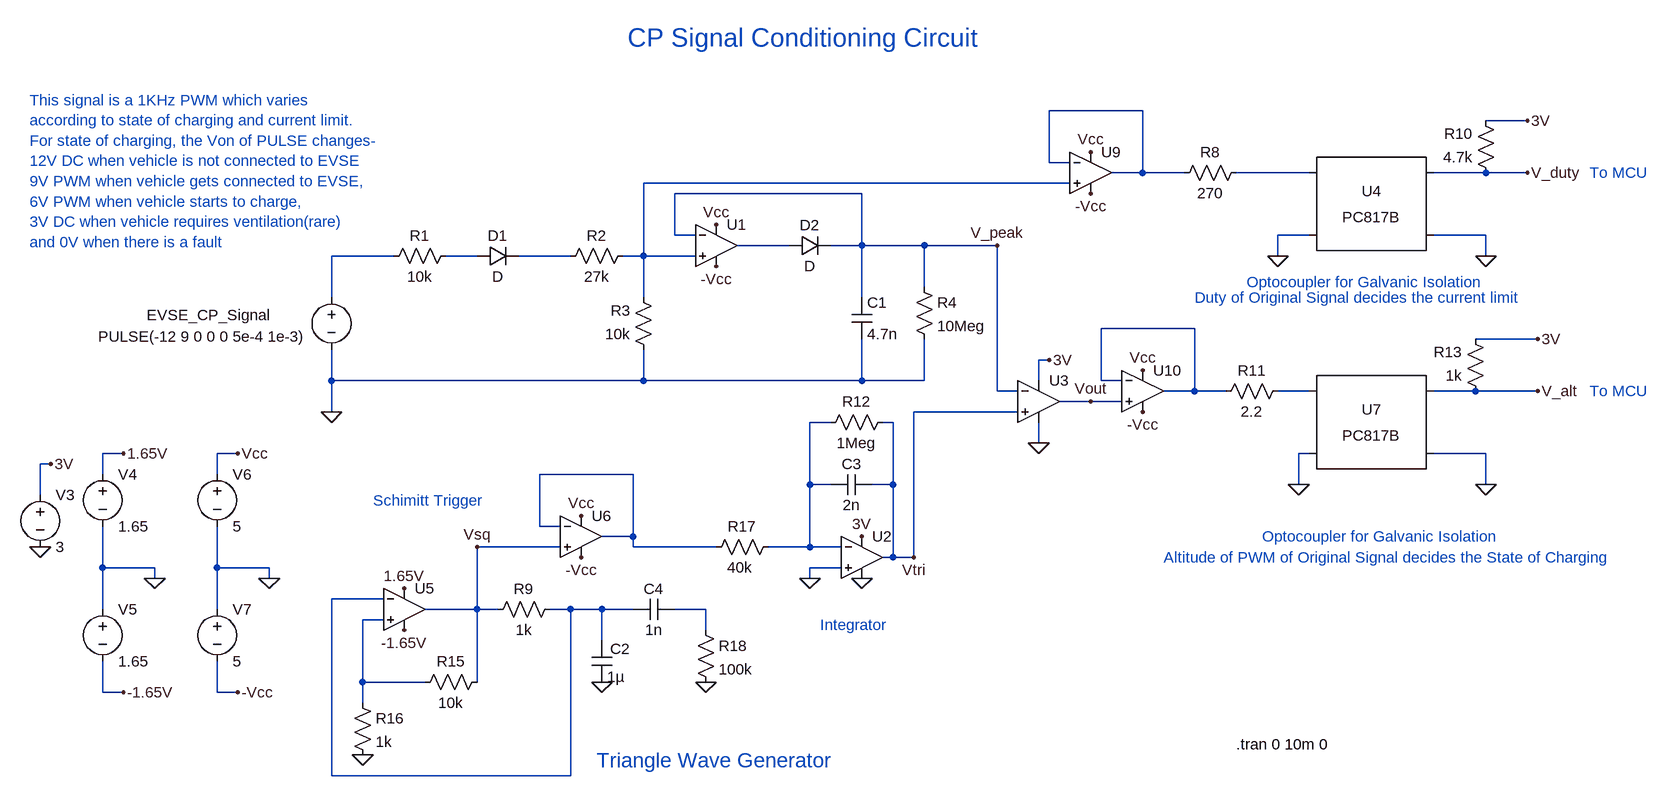
[diagram p0: schematic CP signal.asc]
CP signal.asc, the LTspice schematic file:
Version 4.1
SHEET 1 2740 1312
WIRE 912 -64 768 -64
WIRE 1504 -48 1440 -48
WIRE 768 16 768 -64
WIRE 800 16 768 16
WIRE 912 32 912 -64
WIRE 912 32 864 32
WIRE 976 32 912 32
WIRE 1168 32 1056 32
WIRE 1440 32 1360 32
WIRE 1504 32 1440 32
WIRE 800 48 144 48
WIRE 480 64 192 64
WIRE 192 128 192 64
WIRE 224 128 192 128
WIRE 1168 128 1120 128
WIRE 1440 128 1360 128
WIRE 368 144 288 144
WIRE 480 144 480 64
WIRE 480 144 432 144
WIRE 576 144 480 144
WIRE 688 144 576 144
WIRE -240 160 -336 160
WIRE -112 160 -160 160
WIRE 32 160 -48 160
WIRE 144 160 144 48
WIRE 144 160 112 160
WIRE 224 160 144 160
WIRE 1120 160 1120 128
WIRE 1440 160 1440 128
WIRE 576 208 576 144
WIRE -336 224 -336 160
WIRE 144 224 144 160
WIRE 480 224 480 144
WIRE 992 272 848 272
WIRE 1520 288 1424 288
WIRE 768 320 752 320
WIRE -336 352 -336 304
WIRE 144 352 144 304
WIRE 144 352 -336 352
WIRE 480 352 480 288
WIRE 480 352 144 352
WIRE 576 352 576 288
WIRE 576 352 480 352
WIRE 752 352 752 320
WIRE 848 352 848 272
WIRE 880 352 848 352
WIRE 688 368 688 144
WIRE 720 368 688 368
WIRE 992 368 992 272
WIRE 992 368 944 368
WIRE 1040 368 992 368
WIRE 1168 368 1120 368
WIRE 1424 368 1360 368
WIRE 1520 368 1424 368
WIRE 832 384 784 384
WIRE 880 384 832 384
WIRE -336 400 -336 352
WIRE 720 400 560 400
WIRE 432 416 400 416
WIRE 528 416 512 416
WIRE 752 448 752 416
WIRE -656 464 -688 464
WIRE -480 464 -512 464
WIRE 1168 464 1152 464
WIRE 1440 464 1360 464
WIRE -768 480 -784 480
WIRE -688 496 -688 464
WIRE -512 496 -512 464
WIRE 128 496 -16 496
WIRE 400 512 400 416
WIRE 432 512 400 512
WIRE 528 512 528 416
WIRE 528 512 496 512
WIRE 1152 512 1152 464
WIRE 1440 512 1440 464
WIRE -784 528 -784 480
WIRE -16 576 -16 496
WIRE 16 576 -16 576
WIRE 128 592 128 496
WIRE 128 592 80 592
WIRE 16 608 -112 608
WIRE 128 608 128 592
WIRE 256 608 128 608
WIRE 400 608 400 512
WIRE 400 608 336 608
WIRE 448 608 400 608
WIRE 528 624 528 512
WIRE 528 624 512 624
WIRE 560 624 560 400
WIRE 560 624 528 624
WIRE -688 640 -688 576
WIRE -608 640 -688 640
WIRE -512 640 -512 576
WIRE -432 640 -512 640
WIRE 448 640 400 640
WIRE -608 656 -608 640
WIRE -432 656 -432 640
WIRE 400 656 400 640
WIRE -256 688 -336 688
WIRE -688 704 -688 640
WIRE -512 704 -512 640
WIRE -112 704 -112 608
WIRE -112 704 -192 704
WIRE -80 704 -112 704
WIRE 32 704 0 704
WIRE 80 704 32 704
WIRE 128 704 80 704
WIRE 240 704 192 704
WIRE -256 720 -288 720
WIRE 240 736 240 704
WIRE 80 752 80 704
WIRE -288 816 -288 720
WIRE -192 816 -288 816
WIRE -112 816 -112 704
WIRE -688 832 -688 784
WIRE -656 832 -688 832
WIRE -512 832 -512 784
WIRE -480 832 -512 832
WIRE -288 848 -288 816
WIRE -336 960 -336 688
WIRE 32 960 32 704
WIRE 32 960 -336 960
FLAG -336 400 0
FLAG 256 112 Vcc
FLAG 256 176 -Vcc
FLAG 688 144 V_peak
FLAG 832 384 Vout
FLAG -480 464 Vcc
FLAG -480 832 -Vcc
FLAG 560 624 Vtri
FLAG -432 656 0
FLAG 480 592 3V
FLAG 752 448 0
FLAG -784 608 0
FLAG 1120 160 0
FLAG 1152 512 0
FLAG 1520 368 V_alt
FLAG 1504 32 V_duty
FLAG 832 0 Vcc
FLAG 832 64 -Vcc
FLAG 912 336 Vcc
FLAG 912 400 -Vcc
FLAG 1504 -48 3V
FLAG 1520 288 3V
FLAG 768 320 3V
FLAG -768 480 3V
FLAG 1440 160 0
FLAG 1440 512 0
FLAG -288 928 0
FLAG 80 816 0
FLAG 240 816 0
FLAG 480 656 0
FLAG 48 560 Vcc
FLAG 48 624 -Vcc
FLAG -656 464 1.65V
FLAG -656 832 -1.65V
FLAG -608 656 0
FLAG -224 672 1.65V
FLAG -224 736 -1.65V
FLAG 400 656 0
FLAG -112 608 Vsq
SYMBOL voltage -336 208 R0
WINDOW 3 -359 76 Left 2
WINDOW 123 0 0 Left 0
WINDOW 39 0 0 Left 0
WINDOW 0 -284 43 Left 2
SYMATTR Value PULSE(-12 9 0 0 0 5e-4 1e-3)
SYMATTR InstName EVSE_CP_Signal
SYMBOL res -144 144 R90
WINDOW 0 0 56 VBottom 2
WINDOW 3 32 56 VTop 2
SYMATTR InstName R1
SYMATTR Value 10k
SYMBOL diode -112 176 R270
WINDOW 0 32 32 VTop 2
WINDOW 3 0 32 VBottom 2
SYMATTR InstName D1
SYMBOL res 128 144 R90
WINDOW 0 0 56 VBottom 2
WINDOW 3 32 56 VTop 2
SYMATTR InstName R2
SYMATTR Value 27k
SYMBOL res 160 320 R180
WINDOW 0 36 76 Left 2
WINDOW 3 36 40 Left 2
SYMATTR InstName R3
SYMATTR Value 10k
SYMBOL cap 464 224 R0
SYMATTR InstName C1
SYMATTR Value 4.7n
SYMBOL OpAmps\\UniversalOpAmp2 256 144 R0
SYMATTR InstName U1
SYMBOL diode 368 160 R270
WINDOW 0 32 32 VTop 2
WINDOW 3 0 32 VBottom 2
SYMATTR InstName D2
SYMBOL res 560 192 R0
SYMATTR InstName R4
SYMATTR Value 10Meg
SYMBOL OpAmps\\UniversalOpAmp2 752 384 R0
SYMATTR InstName U3
SYMBOL voltage -512 480 R0
SYMATTR InstName V6
SYMATTR Value 5
SYMBOL OpAmps\\UniversalOpAmp2 480 624 R0
SYMATTR InstName U2
SYMATTR Value2 Avol=1Meg GBW=10Meg Slew=100Meg
SYMBOL res 16 688 R90
WINDOW 0 0 56 VBottom 2
WINDOW 3 32 56 VTop 2
SYMATTR InstName R9
SYMATTR Value 1k
SYMBOL cap 496 496 R90
WINDOW 0 0 32 VBottom 2
WINDOW 3 32 32 VTop 2
SYMATTR InstName C3
SYMATTR Value 2n
SYMBOL voltage -512 688 R0
SYMATTR InstName V7
SYMATTR Value 5
SYMBOL OpAmps\\UniversalOpAmp2 -224 704 R0
SYMATTR InstName U5
SYMBOL res 528 400 R90
WINDOW 0 0 56 VBottom 2
WINDOW 3 32 56 VTop 2
SYMATTR InstName R12
SYMATTR Value 1Meg
SYMBOL voltage -784 512 R0
WINDOW 123 0 0 Left 0
WINDOW 39 0 0 Left 0
SYMATTR InstName V3
SYMATTR Value 3
SYMBOL Optos\\PC817B 1264 80 R0
SYMATTR InstName U4
SYMBOL Optos\\PC817B 1264 416 R0
SYMATTR InstName U7
SYMBOL OpAmps\\UniversalOpAmp2 832 32 R0
SYMATTR InstName U9
SYMBOL OpAmps\\UniversalOpAmp2 912 368 R0
SYMATTR InstName U10
SYMBOL res 1072 16 R90
WINDOW 0 0 56 VBottom 2
WINDOW 3 32 56 VTop 2
SYMATTR InstName R8
SYMATTR Value 270
SYMBOL res 1456 48 R180
WINDOW 0 36 76 Left 2
WINDOW 3 36 40 Left 2
SYMATTR InstName R10
SYMATTR Value 4.7k
SYMBOL res 1136 352 R90
WINDOW 0 0 56 VBottom 2
WINDOW 3 32 56 VTop 2
SYMATTR InstName R11
SYMATTR Value 2.2
SYMBOL res 1440 384 R180
WINDOW 0 36 76 Left 2
WINDOW 3 36 40 Left 2
SYMATTR InstName R13
SYMATTR Value 1k
SYMBOL res -208 832 R270
WINDOW 0 32 56 VTop 2
WINDOW 3 0 56 VBottom 2
SYMATTR InstName R15
SYMATTR Value 10k
SYMBOL res -304 832 R0
SYMATTR InstName R16
SYMATTR Value 1k
SYMBOL cap 64 752 R0
WINDOW 0 29 13 Left 2
SYMATTR InstName C2
SYMATTR Value 1µ
SYMBOL res 352 592 R90
WINDOW 0 0 56 VBottom 2
WINDOW 3 32 60 VTop 2
SYMATTR InstName R17
SYMATTR Value 40k
SYMBOL cap 192 688 R90
WINDOW 0 0 32 VBottom 2
WINDOW 3 32 32 VTop 2
SYMATTR InstName C4
SYMATTR Value 1n
SYMBOL res 224 720 R0
SYMATTR InstName R18
SYMATTR Value 100k
SYMBOL OpAmps\\UniversalOpAmp2 48 592 R0
SYMATTR InstName U6
SYMBOL voltage -688 480 R0
SYMATTR InstName V4
SYMATTR Value 1.65
SYMBOL voltage -688 688 R0
WINDOW 123 0 0 Left 0
WINDOW 39 0 0 Left 0
SYMATTR InstName V5
SYMATTR Value 1.65
TEXT 1056 912 Left 2 !.tran 0 10m 0
TEXT 72 936 Left 3 ;Triangle Wave Generator
TEXT -272 536 Left 2 ;Schimitt Trigger
TEXT 416 728 Left 2 ;Integrator
TEXT 1600 32 Left 2 ;To MCU
TEXT 1600 368 Left 2 ;To MCU
TEXT 1072 200 Left 2 ;Optocoupler for Galvanic Isolation
TEXT 1096 592 Left 2 ;Optocoupler for Galvanic Isolation
TEXT 992 224 Left 2 ;Duty of Original Signal decides the current limit
TEXT 944 624 Left 2 ;Altitude of PWM of Original Signal decides the State of Charging
TEXT 120 -176 Left 4 ;CP Signal Conditioning Circuit
TEXT -800 -80 Left 2 ;This signal is a 1KHz PWM which varies\naccording to state of charging and current limit.\nFor state of charging, the Von of PULSE changes-\n12V DC when vehicle is not connected to EVSE\n9V PWM when vehicle gets connected to EVSE,\n6V PWM when vehicle starts to charge,\n3V DC when vehicle requires ventilation(rare)\nand 0V when there is a fault

The netlist it stands for:
* CP signal.asc
V§EVSE_CP_Signal N005 0 PULSE(-12 9 0 0 0 5e-4 1e-3)
R1 N006 N005 10k
D1 N006 N007 D
R2 N003 N007 27k
R3 0 N003 10k
C1 V_peak 0 4.7n
X§U1 N003 V_peak Vcc -Vcc N004 level2 Avol=1Meg GBW=10Meg Slew=10Meg Ilimit=25m Rail=0 Vos=0 En=0 Enk=0 In=0 Ink=0 Rin=500Meg  ; pins In+ In- V+ V- OUT
D2 N004 V_peak D
R4 V_peak 0 10Meg
X§U3 Vtri V_peak 3V 0 Vout level2 Avol=1Meg GBW=10Meg Slew=10Meg Ilimit=25m Rail=0 Vos=0 En=0 Enk=0 In=0 Ink=0 Rin=500Meg  ; pins In+ In- V+ V- OUT
V6 Vcc 0 5
X§U2 0 N010 3V 0 Vtri level2 Avol=1Meg GBW=10Meg Slew=100Meg Ilimit=25m Rail=0 Vos=0 En=0 Enk=0 In=0 Ink=0 Rin=500Meg  ; pins In+ In- V+ V- OUT
R9 N012 Vsq 1k
C3 Vtri N010 2n
V7 0 -Vcc 5
X§U5 N014 N012 1.65V -1.65V Vsq level2 Avol=1Meg GBW=10Meg Slew=10Meg Ilimit=25m Rail=0 Vos=0 En=0 Enk=0 In=0 Ink=0 Rin=500Meg  ; pins In+ In- V+ V- OUT
R12 Vtri N010 1Meg
V3 3V 0 3
X§U4 N002 0 V_duty 0 PC817 Igain=1.5m
X§U7 N009 0 V_alt 0 PC817 Igain=1.5m
X§U9 N003 N001 Vcc -Vcc N001 level2 Avol=1Meg GBW=10Meg Slew=10Meg Ilimit=25m Rail=0 Vos=0 En=0 Enk=0 In=0 Ink=0 Rin=500Meg  ; pins In+ In- V+ V- OUT
X§U10 Vout N008 Vcc -Vcc N008 level2 Avol=1Meg GBW=10Meg Slew=10Meg Ilimit=25m Rail=0 Vos=0 En=0 Enk=0 In=0 Ink=0 Rin=500Meg  ; pins In+ In- V+ V- OUT
R8 N002 N001 270
R10 V_duty 3V 4.7k
R11 N009 N008 2.2
R13 V_alt 3V 1k
R15 N014 Vsq 10k
R16 N014 0 1k
C2 N012 0 1µ
R17 N010 N011 40k
C4 N013 N012 1n
R18 N013 0 100k
X§U6 Vsq N011 Vcc -Vcc N011 level2 Avol=1Meg GBW=10Meg Slew=10Meg Ilimit=25m Rail=0 Vos=0 En=0 Enk=0 In=0 Ink=0 Rin=500Meg  ; pins In+ In- V+ V- OUT
V4 1.65V 0 1.65
V5 0 -1.65V 1.65
.model D D
.lib standard.dio
.tran 0 10m 0
* Triangle Wave Generator
* Schimitt Trigger
* Integrator
* To MCU
* To MCU
* Optocoupler for Galvanic Isolation
* Optocoupler for Galvanic Isolation
* Duty of Original Signal decides the current limit
* Altitude of PWM of Original Signal decides the State of Charging
* CP Signal Conditioning Circuit
* This signal is a 1KHz PWM which varies
* according to state of charging and current limit.
* For state of charging, the Von of PULSE changes-
* 12V DC when vehicle is not connected to EVSE
* 9V PWM when vehicle gets connected to EVSE,
* 6V PWM when vehicle starts to charge,
* 3V DC when vehicle requires ventilation(rare)
* and 0V when there is a fault
.lib UniversalOpAmp2.lib
.lib PC817.sub
.backanno
.end